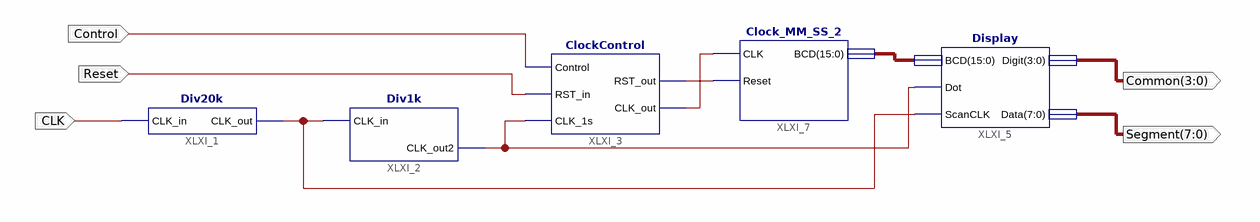
[diagram p0: schematic sheet 1]
// Xilinx ISE schematic StopWatch.sch (spartan6) as structural Verilog: 5 symbols, 5 ports
module StopWatch (
  input  Reset,
  input  Control,
  input  CLK,
  output [3:0] Common,
  output [7:0] Segment
);

  wire XLXN_1, XLXN_4, XLXN_6, XLXN_10;
  wire [15:0] XLXN_8;

  Div20k XLXI_1 (.CLK_in(CLK), .CLK_out(XLXN_4));
  Div1k XLXI_2 (.CLK_in(XLXN_4), .CLK_out2(XLXN_6));
  ClockControl XLXI_3 (.Control(Control), .RST_in(Reset), .CLK_1s(XLXN_6), .CLK_out(XLXN_10), .RST_out(XLXN_1));
  Display XLXI_5 (.BCD(XLXN_8), .Dot(XLXN_6), .ScanCLK(XLXN_4), .Digit(Common), .Data(Segment));
  Clock_MM_SS_2 XLXI_7 (.CLK(XLXN_10), .Reset(XLXN_1), .BCD(XLXN_8));
endmodule
